# Altium schematic sheet Filter.SchDoc
size A4
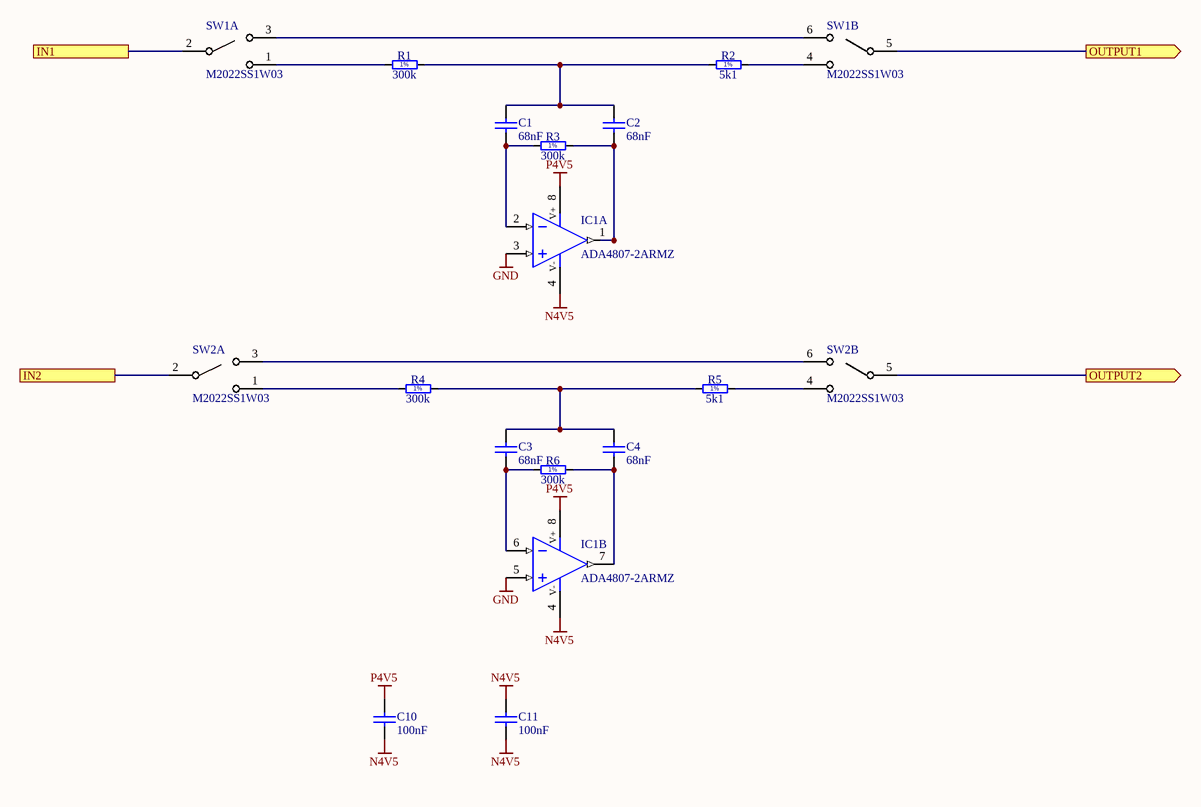
[diagram p0: Filter.SchDoc]

## Parts
C1  68nF  [C0805C683KARACAUTO]
C2  68nF  [C0805C683KARACAUTO]
C3  68nF  [C0805C683KARACAUTO]
C4  68nF  [C0805C683KARACAUTO]
C10  100nF  [C0402C104K4RACTU]
C11  100nF  [C0402C104K4RACTU]
IC1  ADA4807-2ARMZ  [SOP65P490X110-8N]  (parts A,B of 2)
R1  300k  [RESC1608X55N]
R2  5k1  [RESC1608X55N]
R3  300k  [RESC1608X55N]
R4  300k  [RESC1608X55N]
R5  5k1  [RESC1608X55N]
R6  300k  [RESC1608X55N]
SW1  M2022SS1W03  [M2022SS1W03]  (parts A,B of 2)
SW2  M2022SS1W03  [M2022SS1W03]  (parts A,B of 2)

## Ports
IN1, IN2, OUTPUT1 (out), OUTPUT2 (out)

## Nets
GND: IC1.3(IN+) IC1.5(IN+)
N4V5: C10.1 C11.1 C11.2 IC1.4(V-)
P4V5: C10.2 IC1.8(V+)
IN1: SW1.2(COM) ; port IN1
IN2: SW2.2(COM) ; port IN2
OUTPUT1: SW1.5(COM) ; port OUTPUT1
OUTPUT2: SW2.5(COM) ; port OUTPUT2
NetC1_1: C1.1 IC1.2(IN-) R3.1
NetC1_2: C1.2 C2.2 R1.2 R2.1
NetC2_1: C2.1 IC1.1(OUT) R3.2
NetC3_1: C3.1 IC1.6(IN-) R6.1
NetC3_2: C3.2 C4.2 R4.2 R5.1
NetC4_1: C4.1 IC1.7(OUT) R6.2
NetR1_1: R1.1 SW1.1(UP)
NetR2_2: R2.2 SW1.4(UP)
NetR4_1: R4.1 SW2.1(UP)
NetR5_2: R5.2 SW2.4(UP)
NetSW1_3: SW1.3(DOWN) SW1.6(DOWN)
NetSW2_3: SW2.3(DOWN) SW2.6(DOWN)

## Notes on the sheet
- (in symbol R0603_5K1_1%_0.1W_100PPM) 1%
- (in symbol R0603_300K_1%_0.1W_100PPM) 1%

## Library data of the parts
C1-C4 = C0805C683KARACAUTO: Cap Ceramic 0.068uF 250V X7R 10% Pad SMD 0805 125C Automotive T/R; Manufacturer 1: KEMET; Supplier 1: Digi-Key; Manufacturer Part Number 1: C0805C683KARACAUTO; Stock 1: 7245; Pricing 1: 1=0,94000, 10=0,71800, 50=0,59660, 100=0,51370, 500=0,39772, 1000=0,34247 (USD); RoHS: No; Mount: Surface Mount; Case/Package: 0805; Case Code (Imperial): 0805; Case Code (Metric): 2012; Min Operating Temperature: -55°C; Max Operating Temperature: 125°C; Packaging: Tape and Reel; Capacitance: 68nF; Tolerance: 10%; Voltage Rating: 250V; Ratings: AEC-Q200; ComponentLink1URL: https://api.kemet.com/component-edge/download/datasheet/C0805C683KARACAUTO.pdf?src-supplier=Digi-Key; ComponentLink1Description: https://api.kemet.com/component-edge/download/datasheet/C0805C683KARACAUTO.pdf?src-supplier=Digi-Key; ComponentLink2URL: http://www.farnell.com/datasheets/2621747.pdf?src-supplier=Newark; ComponentLink2Description: http://www.farnell.com/datasheets/2621747.pdf?src-supplier=Newark; Supplier Part Number 1: 399-17963-1-ND
C10 C11 = C0402C104K4RACTU: Capacitor; Ceramic; Cap; .100uF; Tol 10%; SMT; Vol-Rtg 16V; X7R; Tape and Reel; Manufacturer 1: KEMET; Dissipation Factor: 3.5%; Supplier 1: Digi-Key; Manufacturer Part Number 1: C0402C104K4RACTU; Stock 1: 636137; Pricing 1: 1=0,10000, 10=0,04000, 50=0,02180, 100=0,01780, 500=0,01270, 1000=0,00998, 2500=0,00908, 5000=0,00835 (USD); RoHS: Yes; Mount: Surface Mount; Case/Package: 0402; Case Code (Imperial): 0402; Case Code (Metric): 1005; Contact Plating: Tin,Matte; Min Operating Temperature: -55°C; Max Operating Temperature: 125°C; Capacitance: 100nF; Tolerance: 10%; Packaging: Tape and Reel; Voltage Rating (DC): 16V; Dielectric: X7R; Package Quantity: 10000; Voltage Rating: 16V; Termination: SMD/SMT; Length: 1mm; Height: 0.5mm; Width: 0.5mm; Depth: 0.5mm; Radiation Hardening: No; ComponentLink1URL: https://datasheet.ciiva.com/45846/docfinderpartnumberc0402c102k5ractu-45846919.pdf?src-supplier=Onlinecomponents.com; ComponentLink1Description: https://datasheet.ciiva.com/45846/docfinderpartnumberc0402c102k5ractu-45846919.pdf?src-supplier=Onlinecomponents.com; ComponentLink2URL: https://datasheet.ciiva.com/18192/getdatasheetpartid-385384-18192412.pdf?src-supplier=Verical; ComponentLink2Description: https://datasheet.ciiva.com/18192/getdatasheetpartid-385384-18192412.pdf?src-supplier=Verical; Supplier Part Number 1: 399-3521-1-ND
IC1 = ADA4807-2ARMZ: Dual Operational Amplifier; Part Description: 3.1 nV/√Hz, 1 mA, 180 MHz, Rail-to-Rail Input/Output Amplifiers; Manufacturer: ANALOG DEVICES; PressFit: No; Bonding: No; Part Number: ADA4807-2ARMZ; Component Kind: Standard; Component Type: Standard; Device: ADA4807-2ARMZ; PackageDescription: SOP, 0.65mm pitch; 8 pin, 3.00mm W X 3.00mm L X 1.10mm H body, IPC Medium Density; Manufacturer Part Number: ADA4807-2ARMZ; Pin Count: 8; Case: MSOP8; Mounted: Yes; Socket: No; SMD: Yes; Sense: No; ComponentHeight: 1.1mm; Author: CERN DEM MR; HelpURL: \\cern.ch\dfs\Applications\Altium\Datasheets\ADA4807-2ARMZ.pdf; CreateDate: 19.02.2016; LatestRevisionDate: 19.02.2016
R1 R3 R4 R6 = R0603_300K_1%_0.1W_100PPM: Resistor - 1%; Part Description: General Purpose Thick Film Chip Resistor; Manufacturer: GENERIC; Manufacturer1 Part Number: NRC06F3003TRF; Power: 0.1W; TC: ±100ppm/°C; PressFit: No; Part Number: R0603_300K_1%_0.1W_100PPM; Component Kind: Standard; Component Type: Standard; Pin Count: 2; Value: 300k; Status: Preferred; Tolerance: ±1%; Manufacturer Part Number: R0603_300K_1%_0.1W_100PPM; Case: 0603; Mounted: Yes; Sense: No; Socket: No; SMD: Yes; Manufacturer1 Example: NIC COMPONENT; Manufacturer1 ComponentHeight: 0.55mm; HelpURL: \\cern.ch\dfs\Applications\Altium\Datasheets\R0603_NIC_NRC.pdf; Author: CERN DEM JLC; CreateDate: 03.12.2007; LatestRevisionDate: 13.03.2008
R2 R5 = R0603_5K1_1%_0.1W_100PPM: Resistor - 1%; Part Description: General Purpose Thick Film Chip Resistor; Manufacturer: GENERIC; Manufacturer1 Part Number: NRC06F5101TRF; Power: 0.1W; TC: ±100ppm/°C; PressFit: No; Part Number: R0603_5K1_1%_0.1W_100PPM; Component Kind: Standard; Component Type: Standard; Pin Count: 2; Value: 5k1; Status: Preferred; Tolerance: ±1%; Manufacturer Part Number: R0603_5K1_1%_0.1W_100PPM; Case: 0603; Mounted: Yes; Sense: No; Socket: No; SMD: Yes; Manufacturer1 Example: NIC COMPONENT; Manufacturer1 ComponentHeight: 0.55mm; HelpURL: \\cern.ch\dfs\Applications\Altium\Datasheets\R0603_NIC_NRC.pdf; Author: CERN DEM JLC; CreateDate: 03.12.2007; LatestRevisionDate: 13.03.2008
SW1 SW2 = M2022SS1W03: SWITCH TOGGLE DPDT 6A 125V ON-NONE-ON; Manufacturer 1: NKK Switches; Actuator Material: Brass,Chrome; Current Rating: 4A; Voltage Rating (AC): 250V; Voltage Rating (DC): 30V; Illumination Type: Non-Illuminated,Illuminated; Electrical Life: 25000Cycles; Switch Function: On-On; Actuator Type: Standard Round; Number of Poles: 2; Insulation Resistance: 1GR; Actuator Length: 10.5mm; Supplier 1: Digi-Key; Manufacturer Part Number 1: M2022SS1W03; Stock 1: 161; Pricing 1: 1=5,31000, 10=4,73800, 25=4,48520, 50=4,32400, 100=4,11700, 250=3,93300, 500=3,58800, 1000=3,40400 (USD); RoHS: Yes; Mount: Panel; Number of Pins: 2; Contact Plating: Silver; Contact Material: Silver; Min Operating Temperature: -30°C; Max Operating Temperature: 85°C; Throw Configuration: DPDT; Packaging: Bulk; Termination: PC Pin; Package Quantity: 1; Orientation: Vertical; Max Voltage Rating (AC): 250V; Max Current Rating: 6A; Max Voltage Rating (DC): 30V; Number of Positions: 2; Length: 13mm; Width: 12.7mm; Depth: 12.7mm; Lead Free: Lead Free; REACH SVHC: No SVHC; Flammability Rating: UL94 V-0; ComponentLink1URL: https://datasheet.ciiva.com/29338/709074-da-01-en-kipphebels-2polon-on8-9mmpc-pins-29338588.pdf?src-supplier=Conrad; ComponentLink1Description: https://datasheet.ciiva.com/29338/709074-da-01-en-kipphebels-2polon-on8-9mmpc-pins-29338588.pdf?src-supplier=Conrad; ComponentLink2URL: https://datasheet.ciiva.com/14538/70192013-14538476.pdf?src-supplier=Allied+Electronics; ComponentLink2Description: https://datasheet.ciiva.com/14538/70192013-14538476.pdf?src-supplier=Allied+Electronics; ComponentLink3URL: https://datasheet.ciiva.com/2904/mtogglesbushing-2904493.pdf?src-supplier=Digi-Key; ComponentLink3Description: https://datasheet.ciiva.com/2904/mtogglesbushing-2904493.pdf?src-supplier=Digi-Key; ComponentLink4URL: https://datasheet.ciiva.com/16389/mtogglesbushing-16389726.pdf?src-supplier=Future+Electronics; ComponentLink4Description: https://datasheet.ciiva.com/16389/mtogglesbushing-16389726.pdf?src-supplier=Future+Electronics; Supplier Part Number 1: 360-1844-ND